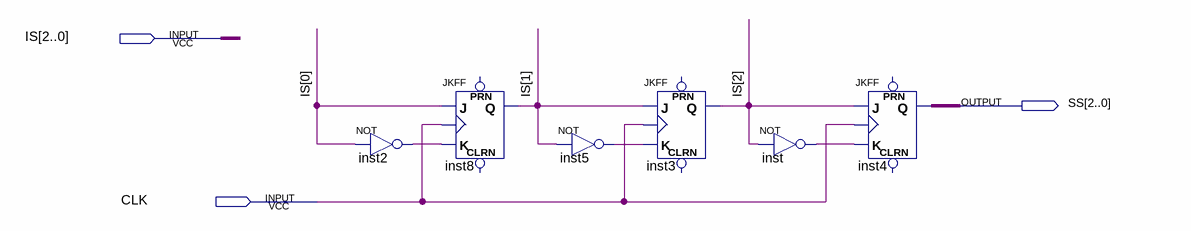
[diagram p0: schematic sheet]
// Quartus schematic Registrador_Serial_Serial.bdf as structural Verilog: 6 symbols, 3 pins
module Registrador_Serial_Serial (
  input  [2:0] IS,
  input  CLK,
  output [2:0] SS
);

  wire inst2_out, inst5_out, inst_out;

  not inst2 (inst2_out, IS[0]);
  JKFF inst8 (.K(inst2_out), .J(IS[0]), .CLK(CLK), .Q(IS[1]));  // open: PRN, CLRN
  not inst5 (inst5_out, IS[1]);
  JKFF inst3 (.K(inst5_out), .J(IS[1]), .CLK(CLK), .Q(IS[2]));  // open: PRN, CLRN
  not inst (inst_out, IS[2]);
  JKFF inst4[2:0] (.K(inst_out), .J(IS[2]), .CLK(CLK), .Q(SS));  // open: PRN, CLRN
endmodule
